# Altium schematic sheet BLUENRG-M2SP.SchDoc
size A4
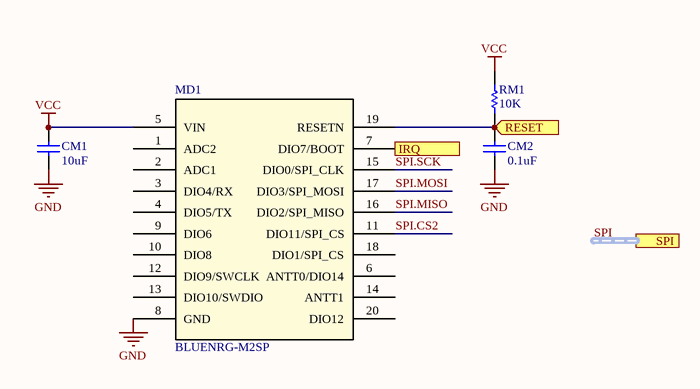
[diagram p0: BLUENRG-M2SP.SchDoc]

## Parts
CM1  value 10uF  [C0603[1608X92]]  (hidden comment: 10uF 6.3V 0603)
CM2  value 0.1uF  [C0603[1608X92]]  (hidden comment: 0.1uF 16V 0603)
MD1  BLUENRG-M2SP  [BLUENRG-M2SP]
RM1  value 10K  [R0603[1608]]  (hidden comment: 10K 1% 0603)

## Ports
IRQ (out), RESET (in), SPI (harness SPI)

## Nets
GND: CM1.2 CM2.2 MD1.8(GND)
VCC: CM1.1 MD1.5(VIN) RM1.2
IRQ: MD1.7(DIO7/BOOT) ; port IRQ
RESET: CM2.1 MD1.19(RESETN) RM1.1 ; port RESET
SPI.CS2: MD1.11(DIO11/SPI_CS)
SPI.MISO: MD1.16(DIO2/SPI_MISO)
SPI.MOSI: MD1.17(DIO3/SPI_MOSI)
SPI.SCK: MD1.15(DIO0/SPI_CLK)

Not connected (* = marked no-connect by the designer): MD1 1(ADC2) 2(ADC1) 3(DIO4/RX) 4(DIO5/TX) 6(ANTT0/DIO14) 9(DIO6) 10(DIO8) 12(DIO9/SWCLK) 13(DIO10/SWDIO) 14(ANTT1) 18(DIO1/SPI_CS) 20(DIO12)

## Buses and harness runs
harness SPI = port SPI

## Library data of the parts
CM1 = CAP_10uF_6.3V_0603_10%: 10uF 6.3V 10% 0603 (1608 Metric); PartNumber: GRM188R60J106KE47D; Manufacturer: Murata; TemperatureCoefficient: X5R; Mounting Technology: Surface Mount; PackageReference: 0603; PackageDescription: 0603 (1608 Metric); Voltage: 6.3V; Tolerance: 10%
CM2 = CAP_0.1uF_16V_0603_10%: 0.1uF 16V 10% 0603 (1608 Metric); PartNumber: GCM188R71C104KA37D; Manufacturer: Murata; TemperatureCoefficient: X7R; Mounting Technology: Surface Mount; PackageReference: 0603; PackageDescription: 0603 (1608 Metric); Voltage: 16V; Tolerance: 10%
MD1 = BLUENRG-M2SP: Manufacturer: STMicroelectronics; PartNumber: BLUENRG-M2SP
RM1 = RES_10K_0603_1%: 10K 0.25W 1% 0603 (1005 Metric); Manufacturer: Vishay / Dale; PartNumber: CRCW060310K0FKEAHP; Tolerance: 1%; Power: 0.25W; Mounting Technology: Surface Mount; PackageReference: 0603; PackageDescription: 0603 (1608 Metric); ComponentLink1Description: Datasheet; ComponentLink1URL: http://www.vishay.com/docs/20065/rcse3.pdf